# Altium project SMHome_Hardware.PrjPcb
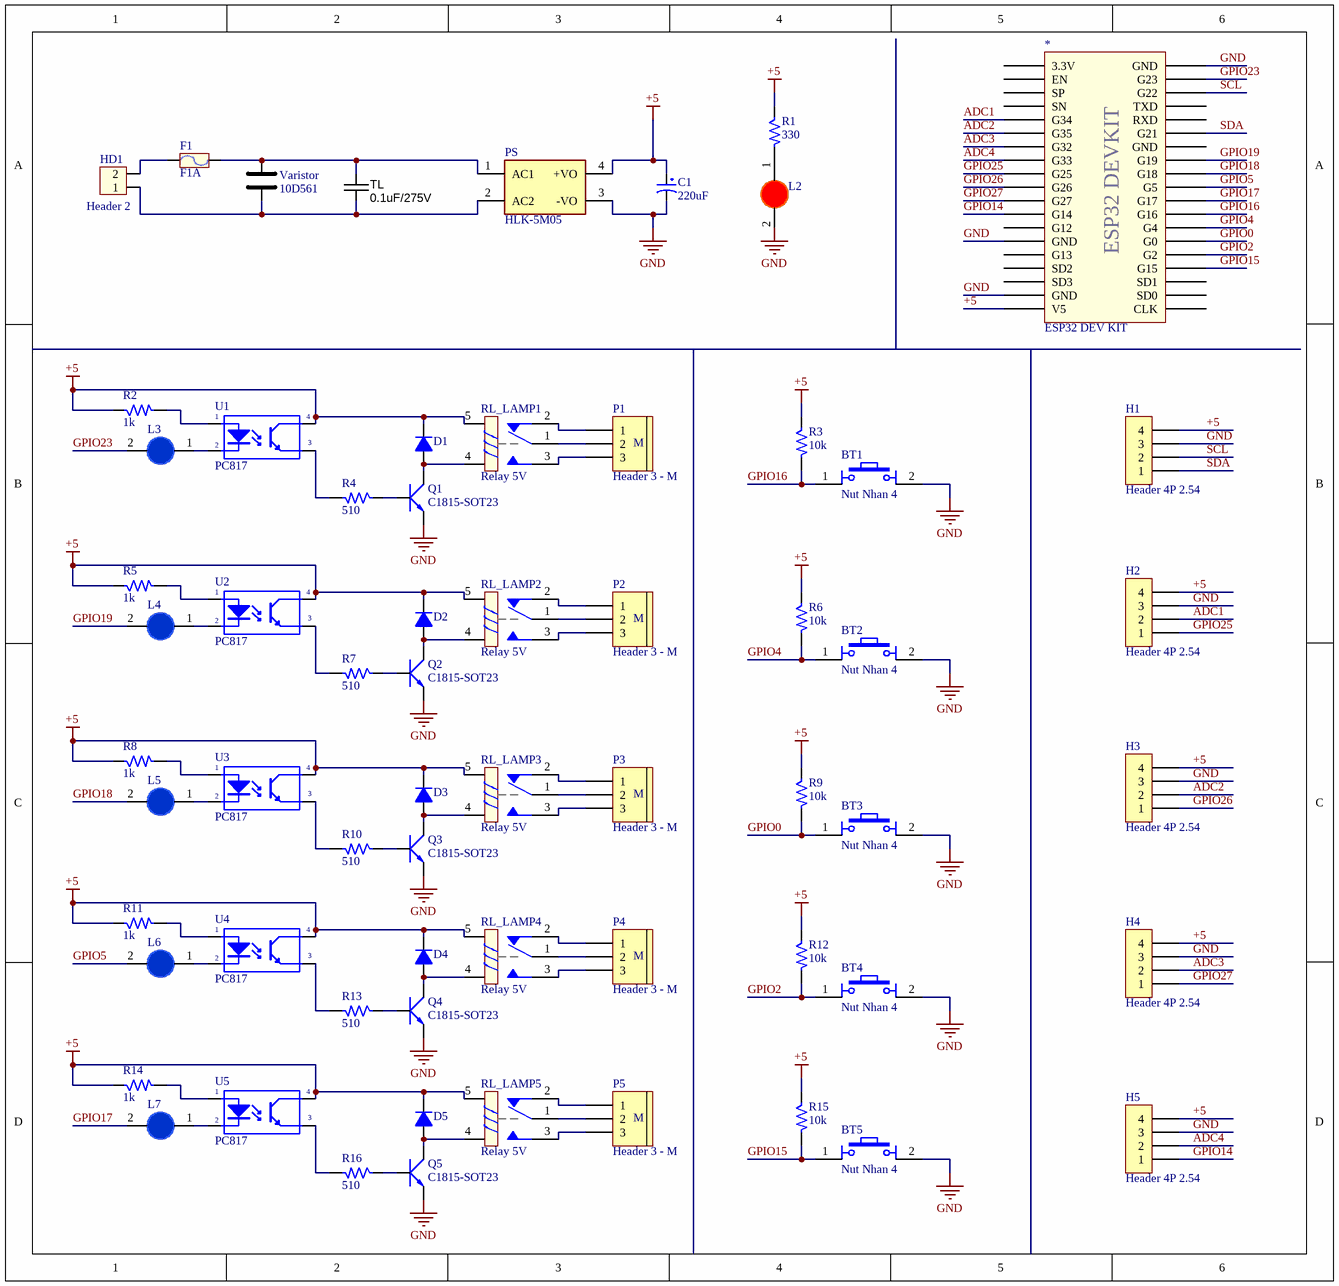
[diagram p0: SMHome_SDNL.SchDoc]
1 sheet, 64 parts. Net scope: global (net labels, ports and power ports of the same name join across sheets).
Board file: SMHome_PCB.PcbDoc

## Sheet SMHome_SDNL.SchDoc
size 250 x 240 mm; SheetNumber: 1; SheetTotal: 1

### Parts
*  ESP32 DEV KIT  [ESP32 DEVKIT]
BT1  Nut Nhan 4  [Nut Nhan 4 Chan Cam 6x6]
BT2  Nut Nhan 4  [Nut Nhan 4 Chan Cam 6x6]
BT3  Nut Nhan 4  [Nut Nhan 4 Chan Cam 6x6]
BT4  Nut Nhan 4  [Nut Nhan 4 Chan Cam 6x6]
BT5  Nut Nhan 4  [Nut Nhan 4 Chan Cam 6x6]
C1  220uF  [CP1.5/3.4]
D1  Diode  1N4007  [DO-214AC]  (value not drawn)
D2  Diode  1N4007  [DO-214AC]  (value not drawn)
D3  Diode  1N4007  [DO-214AC]  (value not drawn)
D4  Diode  1N4007  [DO-214AC]  (value not drawn)
D5  Diode  1N4007  [DO-214AC]  (value not drawn)
F1  F1A  [Fuse]
H1  Header 4P 2.54  [XH2.54M-4]
H2  Header 4P 2.54  [XH2.54M-4]
H3  Header 4P 2.54  [XH2.54M-4]
H4  Header 4P 2.54  [XH2.54M-4]
H5  Header 4P 2.54  [XH2.54M-4]
HD1  Header 2  [HED2]
L2  (no value)  [LED-1206-Red]
L3  (no value)  [LED-1206-Blue]
L4  (no value)  [LED-1206-Blue]
L5  (no value)  [LED-1206-Blue]
L6  (no value)  [LED-1206-Blue]
L7  (no value)  [LED-1206-Blue]
P1  Header 3 - M  [Medium - Header 3]
P2  Header 3 - M  [Medium - Header 3]
P3  Header 3 - M  [Medium - Header 3]
P4  Header 3 - M  [Medium - Header 3]
P5  Header 3 - M  [Medium - Header 3]
PS  HLK-5M05  [Nguon HI-LINK 5M05]
Q1  C1815-SOT23  [SOT-23]
Q2  C1815-SOT23  [SOT-23]
Q3  C1815-SOT23  [SOT-23]
Q4  C1815-SOT23  [SOT-23]
Q5  C1815-SOT23  [SOT-23]
R1  330  [SM-RES-1206]
R2  1k  [SM-RES-1206]
R3  10k  [SM-RES-1206]
R4  510  [SM-RES-1206]
R5  1k  [SM-RES-1206]
R6  10k  [SM-RES-1206]
R7  510  [SM-RES-1206]
R8  1k  [SM-RES-1206]
R9  10k  [SM-RES-1206]
R10  510  [SM-RES-1206]
R11  1k  [SM-RES-1206]
R12  10k  [SM-RES-1206]
R13  510  [SM-RES-1206]
R14  1k  [SM-RES-1206]
R15  10k  [SM-RES-1206]
R16  510  [SM-RES-1206]
RL_LAMP1  Relay 5V  [RL_SPDT_10A]
RL_LAMP2  Relay 5V  [RL_SPDT_10A]
RL_LAMP3  Relay 5V  [RL_SPDT_10A]
RL_LAMP4  Relay 5V  [RL_SPDT_10A]
RL_LAMP5  Relay 5V  [RL_SPDT_10A]
TL  0.1uF/275V  [CAPM50P720300X650_VERT]
U1  PC817  [DIP4/W0.3]
U2  PC817  [DIP4/W0.3]
U3  PC817  [DIP4/W0.3]
U4  PC817  [DIP4/W0.3]
U5  PC817  [DIP4/W0.3]
Varistor  10D561  [103/2KV]

### Nets
+5: *.19(V5) C1.1 D1.K D2.K D3.K D4.K D5.K H1.4 H2.4 H3.4 H4.4 H5.4 PS.4(+VO) R1.1 R2.1 R3.1 R5.1 R6.1 R8.1 R9.1 R11.1 R12.1 R14.1 R15.1 RL_LAMP1.5 RL_LAMP2.5 RL_LAMP3.5 RL_LAMP4.5 RL_LAMP5.5 U1.4(C) U2.4(C) U3.4(C) U4.4(C) U5.4(C)
GND: *.14(GND) *.18(GND) *.38(GND) BT1.2 BT2.2 BT3.2 BT4.2 BT5.2 C1.2 H1.3 H2.3 H3.3 H4.3 H5.3 L2.2(K) PS.3(-VO) Q1.2(E) Q2.2(E) Q3.2(E) Q4.2(E) Q5.2(E)
ADC1: *.5(G34) H2.2
ADC2: *.6(G35) H3.2
ADC3: *.7(G32) H4.2
ADC4: *.8(G33) H5.2
GPIO0: *.25(G0) BT3.1 R9.2
GPIO2: *.24(G2) BT4.1 R12.2
GPIO4: *.26(G4) BT2.1 R6.2
GPIO5: *.29(G5) L6.2(K)
GPIO14: *.12(G14) H5.1
GPIO15: *.23(G15) BT5.1 R15.2
GPIO16: *.27(G16) BT1.1 R3.2
GPIO17: *.28(G17) L7.2(K)
GPIO18: *.30(G18) L5.2(K)
GPIO19: *.31(G19) L4.2(K)
GPIO23: *.37(G23) L3.2(K)
GPIO25: *.9(G25) H2.1
GPIO26: *.10(G26) H3.1
GPIO27: *.11(G27) H4.1
SCL: *.36(G22) H1.2
SDA: *.33(G21) H1.1
NetD1_A: D1.A Q1.3(C) RL_LAMP1.4
NetD2_A: D2.A Q2.3(C) RL_LAMP2.4
NetD3_A: D3.A Q3.3(C) RL_LAMP3.4
NetD4_A: D4.A Q4.3(C) RL_LAMP4.4
NetD5_A: D5.A Q5.3(C) RL_LAMP5.4
NetF1_1: F1.1 HD1.2
NetF1_2: F1.2 PS.1(AC1) TL.1 Varistor.2
NetHD1_1: HD1.1 PS.2(AC2) TL.2 Varistor.1
NetL2_1: L2.1(A) R1.2
NetL3_1: L3.1(A) U1.2(K)
NetL4_1: L4.1(A) U2.2(K)
NetL5_1: L5.1(A) U3.2(K)
NetL6_1: L6.1(A) U4.2(K)
NetL7_1: L7.1(A) U5.2(K)
NetP1_1: P1.1 RL_LAMP1.2
NetP1_2: P1.2 RL_LAMP1.1
NetP1_3: P1.3 RL_LAMP1.3
NetP2_1: P2.1 RL_LAMP2.2
NetP2_2: P2.2 RL_LAMP2.1
NetP2_3: P2.3 RL_LAMP2.3
NetP3_1: P3.1 RL_LAMP3.2
NetP3_2: P3.2 RL_LAMP3.1
NetP3_3: P3.3 RL_LAMP3.3
NetP4_1: P4.1 RL_LAMP4.2
NetP4_2: P4.2 RL_LAMP4.1
NetP4_3: P4.3 RL_LAMP4.3
NetP5_1: P5.1 RL_LAMP5.2
NetP5_2: P5.2 RL_LAMP5.1
NetP5_3: P5.3 RL_LAMP5.3
NetQ1_1: Q1.1(B) R4.1
NetQ2_1: Q2.1(B) R7.1
NetQ3_1: Q3.1(B) R10.1
NetQ4_1: Q4.1(B) R13.1
NetQ5_1: Q5.1(B) R16.1
NetR2_2: R2.2 U1.1(A)
NetR4_2: R4.2 U1.3(E)
NetR5_2: R5.2 U2.1(A)
NetR7_2: R7.2 U2.3(E)
NetR8_2: R8.2 U3.1(A)
NetR10_2: R10.2 U3.3(E)
NetR11_2: R11.2 U4.1(A)
NetR13_2: R13.2 U4.3(E)
NetR14_2: R14.2 U5.1(A)
NetR16_2: R16.2 U5.3(E)

Not connected (* = marked no-connect by the designer): * 1(3.3V) 2(EN) 3(SP) 4(SN) 13(G12) 15(G13) 16(SD2) 17(SD3) 20(CLK) 21(SD0) 22(SD1) 32(GND) 34(RXD) 35(TXD)

### Notes on the sheet
- (in symbol ESP32 DEV KIT) ESP32 DEVKIT
- (in symbol Header 3 - M) M

### Library data of the parts
BT1-BT5 = Nut Nhan 4 Chan Cam 6x6: Nut Nhan 4 Chan 6x6mm; Ten: Nút Nhấn 4 Chân 6x6x5MM DIP; Ma_Hang: MH004584
C1 = CP3: Cap 100uF/35V - 470uF/16V; Value: 100uF/35V/50V; Description 1: 1000uF/6,3V - 470uF/16V - 330uF - 25V; Description 2: 220uF/35V - 100uF/50V - 63V - 4,7uF/200V; Description 3: 22uF => 33uF100V - 3,3uF => 4,7uF/250V; Description 4: 2,2uF =>3,3uF/350 - 2,2uF/400V - 1uF/450V
D1-D5 = Diode  1N4007: Diode 1A; Value: 1N4007
F1 = Fuse: Designed by: VanDungEvn; Value: Fuse
H1-H5 = Header 4P 2.54 Duc Thang: Cắm; Ten_Linh_Kien: Header 4P XH2.54-4P Đực Thẳng; Don_Vi: Con; Ma_Hang: MH001285; Chung_Loai: Cắm
HD1 = Header 2: Header 2 (Green); Value: Header 2
L2 = LED 1206 Do: Dán; Don_Vi: Con; Ma_Hang: MH002334; Ten_Linh_Kien: LED1206 Màu Đỏ (Red); Ghi_Chu: *; Kieu_Chan: *; Chung_Loai: Dán
L3-L7 = LED 1206 Xanh Duong: Dán; Don_Vi: Con; Ma_Hang: MH002333; Ten_Linh_Kien: LED1206 Màu Xanh Dương (Blue); Ghi_Chu: *; Kieu_Chan: *; Chung_Loai: Dán
P1-P5 = Header 3 - M: Header, 3-Pin, Medium; LatestRevisionDate: 17-Jul-2002; LatestRevisionNote: Re-released for DXP Platform.; Publisher: Altium Limited
PS = Nguon Hi-Link HLK-5M05: AC DC 220V to 5V 5W 5Watt Isolated Switching Step-Down Power Supply Module Converter; Availability: Unavailable; SnapEDA_Link: https://www.snapeda.com/parts/HLK-5M05/Hi-link/view-part/2758659/?ref=snap; MF: Hi-link; Price: None; Package: Package Analog Devices; MP: HLK-5M05; Value: *
Q1-Q5 = Trans C1815 HF SMD: SOT-23; Value: C9014
R1-R16 = R: Resistor 1/4W; Value: R1/4W - 1K
RL_LAMP1-RL_LAMP5 = Relay 1: Relay SPDT,10A - 12VDC 5 Pin; Value: Relay SPDT, 10A, 12V
TL = CAPMF_330n_TH_MPET_63VDC_10%: Capacitor THD Metallized PET Film 330nF 10% 63VDC; Manufacturer 1: EPCOS Inc; Manufacturer Part Number 1: B32529C334K; Ratings: 63VDC; 40VAC; SCDType: source; Package / Case: Radial; Tolerance: ±10%; Material: Metallized Polyester; Operating Temperature: -55°C ~ 125°C; ComponentLink1URL: http://www.epcos.com/inf/20/20/db/fc_2009/MKT_B32520_529.pdf; ComponentLink1Description: http://www.epcos.com/inf/20/20/db/fc_2009/MKT_B32520_529.pdf; Supplier 1: Digi-Key; Supplier Part Number 1: 495-2548-ND; Height - Seated (Max): 6.50mm; Lead Spacing: 5.00mm; Size / Dimension: 7.20mm L x 3.00mm W max; Value: 0.1uF/275V
U1-U5 = PC817: Single Opto; Value: PC817
Varistor = 103/2KV